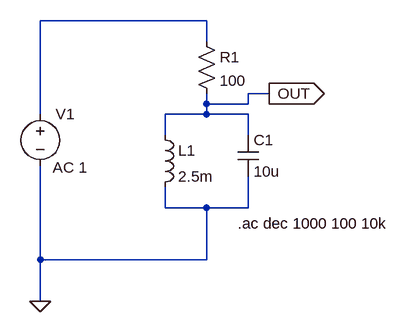
[diagram p0: schematic AC.asc]
AC.asc, the LTspice schematic file:
Version 4
SHEET 1 880 680
WIRE 288 -48 32 -48
WIRE 288 -16 288 -48
WIRE 384 64 352 64
WIRE 288 80 288 64
WIRE 352 80 352 64
WIRE 352 80 288 80
WIRE 32 96 32 -48
WIRE 288 96 288 80
WIRE 288 96 224 96
WIRE 352 96 288 96
WIRE 224 128 224 96
WIRE 352 128 352 96
WIRE 224 240 224 208
WIRE 288 240 224 240
WIRE 352 240 352 192
WIRE 352 240 288 240
WIRE 32 320 32 176
WIRE 288 320 288 240
WIRE 288 320 32 320
WIRE 32 384 32 320
FLAG 32 384 0
FLAG 384 64 OUT
IOPIN 384 64 Out
SYMBOL voltage 32 80 R0
WINDOW 123 19 98 Left 2
WINDOW 39 0 0 Left 0
SYMATTR InstName V1
SYMATTR Value ""
SYMATTR Value2 AC 1
SYMBOL ind 208 112 R0
SYMATTR InstName L1
SYMATTR Value 2.5m
SYMBOL cap 336 128 R0
SYMATTR InstName C1
SYMATTR Value 10u
SYMBOL res 272 -32 R0
SYMATTR InstName R1
SYMATTR Value 100
TEXT 336 264 Left 2 !.ac dec 1000 100 10k

The netlist it stands for:
* AC.asc
V1 N001 0 AC 1
L1 OUT 0 2.5m
C1 OUT 0 10u
R1 N001 OUT 100
.ac dec 1000 100 10k
.backanno
.end